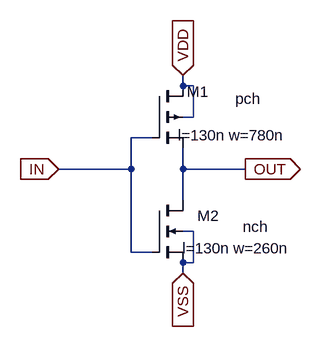
[diagram p0: schematic Inverter1.asc]
Inverter1.asc, the LTspice schematic file:
Version 4.1
SHEET 1 880 680
WIRE 176 32 176 16
WIRE 192 32 176 32
WIRE 192 80 192 32
WIRE 192 80 176 80
WIRE 128 112 96 112
WIRE 96 160 96 112
WIRE 96 160 -16 160
WIRE 176 160 176 128
WIRE 272 160 176 160
WIRE 176 208 176 160
WIRE 192 256 176 256
WIRE 96 288 96 160
WIRE 128 288 96 288
WIRE 192 304 192 256
WIRE 192 304 176 304
WIRE 176 320 176 304
FLAG -16 160 IN
IOPIN -16 160 In
FLAG 176 16 VDD
IOPIN 176 16 In
FLAG 176 320 VSS
IOPIN 176 320 In
FLAG 272 160 OUT
IOPIN 272 160 Out
SYMBOL pmos4 128 32 R0
WINDOW 0 88 9 Right 2
WINDOW 3 168 20 Right 2
WINDOW 123 206 76 Right 2
SYMATTR InstName M1
SYMATTR Value pch
SYMATTR Value2 l=130n w=780n
SYMBOL nmos4 128 208 R0
WINDOW 0 104 24 Right 2
WINDOW 3 179 41 Right 2
WINDOW 123 213 74 Right 2
SYMATTR InstName M2
SYMATTR Value nch
SYMATTR Value2 l=130n w=260n

The netlist it stands for:
* Inverter1.asc
M1 VDD IN OUT VDD pch l=130n w=780n
M2 OUT IN VSS VSS nch l=130n w=260n
.model NMOS NMOS
.model PMOS PMOS
.lib standard.mos
.backanno
.end